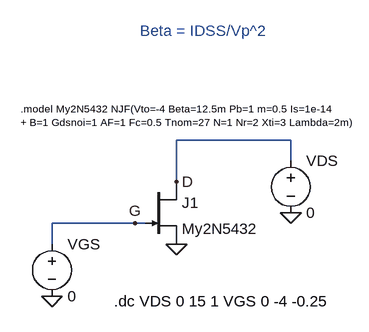
[diagram p0: schematic 008 JFET.asc]
008 JFET.asc, the LTspice schematic file:
Version 4
SHEET 1 2736 680
WIRE 352 -32 176 -32
WIRE 352 0 352 -32
WIRE 176 32 176 -32
WIRE 112 96 -16 96
WIRE 128 96 112 96
WIRE -16 128 -16 96
FLAG -16 208 0
FLAG 352 80 0
FLAG 176 32 D
FLAG 112 96 G
FLAG 176 128 0
SYMBOL voltage -16 112 R0
SYMATTR InstName VGS
SYMATTR Value 0
SYMBOL voltage 352 -16 R0
SYMATTR InstName VDS
SYMATTR Value 0
SYMBOL njf 128 32 R0
SYMATTR InstName J1
SYMATTR Value My2N5432
TEXT 80 216 Left 2 !.dc VDS 0 15 1 VGS 0 -4 -0.25
TEXT -64 -80 Left 1 !.model My2N5432 NJF(Vto=-4 Beta=12.5m Pb=1 m=0.5 Is=1e-14\n+ B=1 Gdsnoi=1 AF=1 Fc=0.5 Tnom=27 N=1 Nr=2 Xti=3 Lambda=2m)
TEXT 120 -200 Left 2 ;Beta = IDSS/Vp^2

The netlist it stands for:
* 008 JFET.asc
VGS G 0 0
VDS D 0 0
J1 D G 0 My2N5432
.model NJF NJF
.model PJF PJF
.lib standard.jft
.dc VDS 0 15 1 VGS 0 -4 -0.25
.model My2N5432 NJF(Vto=-4 Beta=12.5m Pb=1 m=0.5 Is=1e-14
+ B=1 Gdsnoi=1 AF=1 Fc=0.5 Tnom=27 N=1 Nr=2 Xti=3 Lambda=2m)
* Beta = IDSS/Vp^2
.backanno
.end